# EAGLE schematic Arduino-M0-Mod1 (EAGLE 7.5.0)

## Sheet 1 of 2
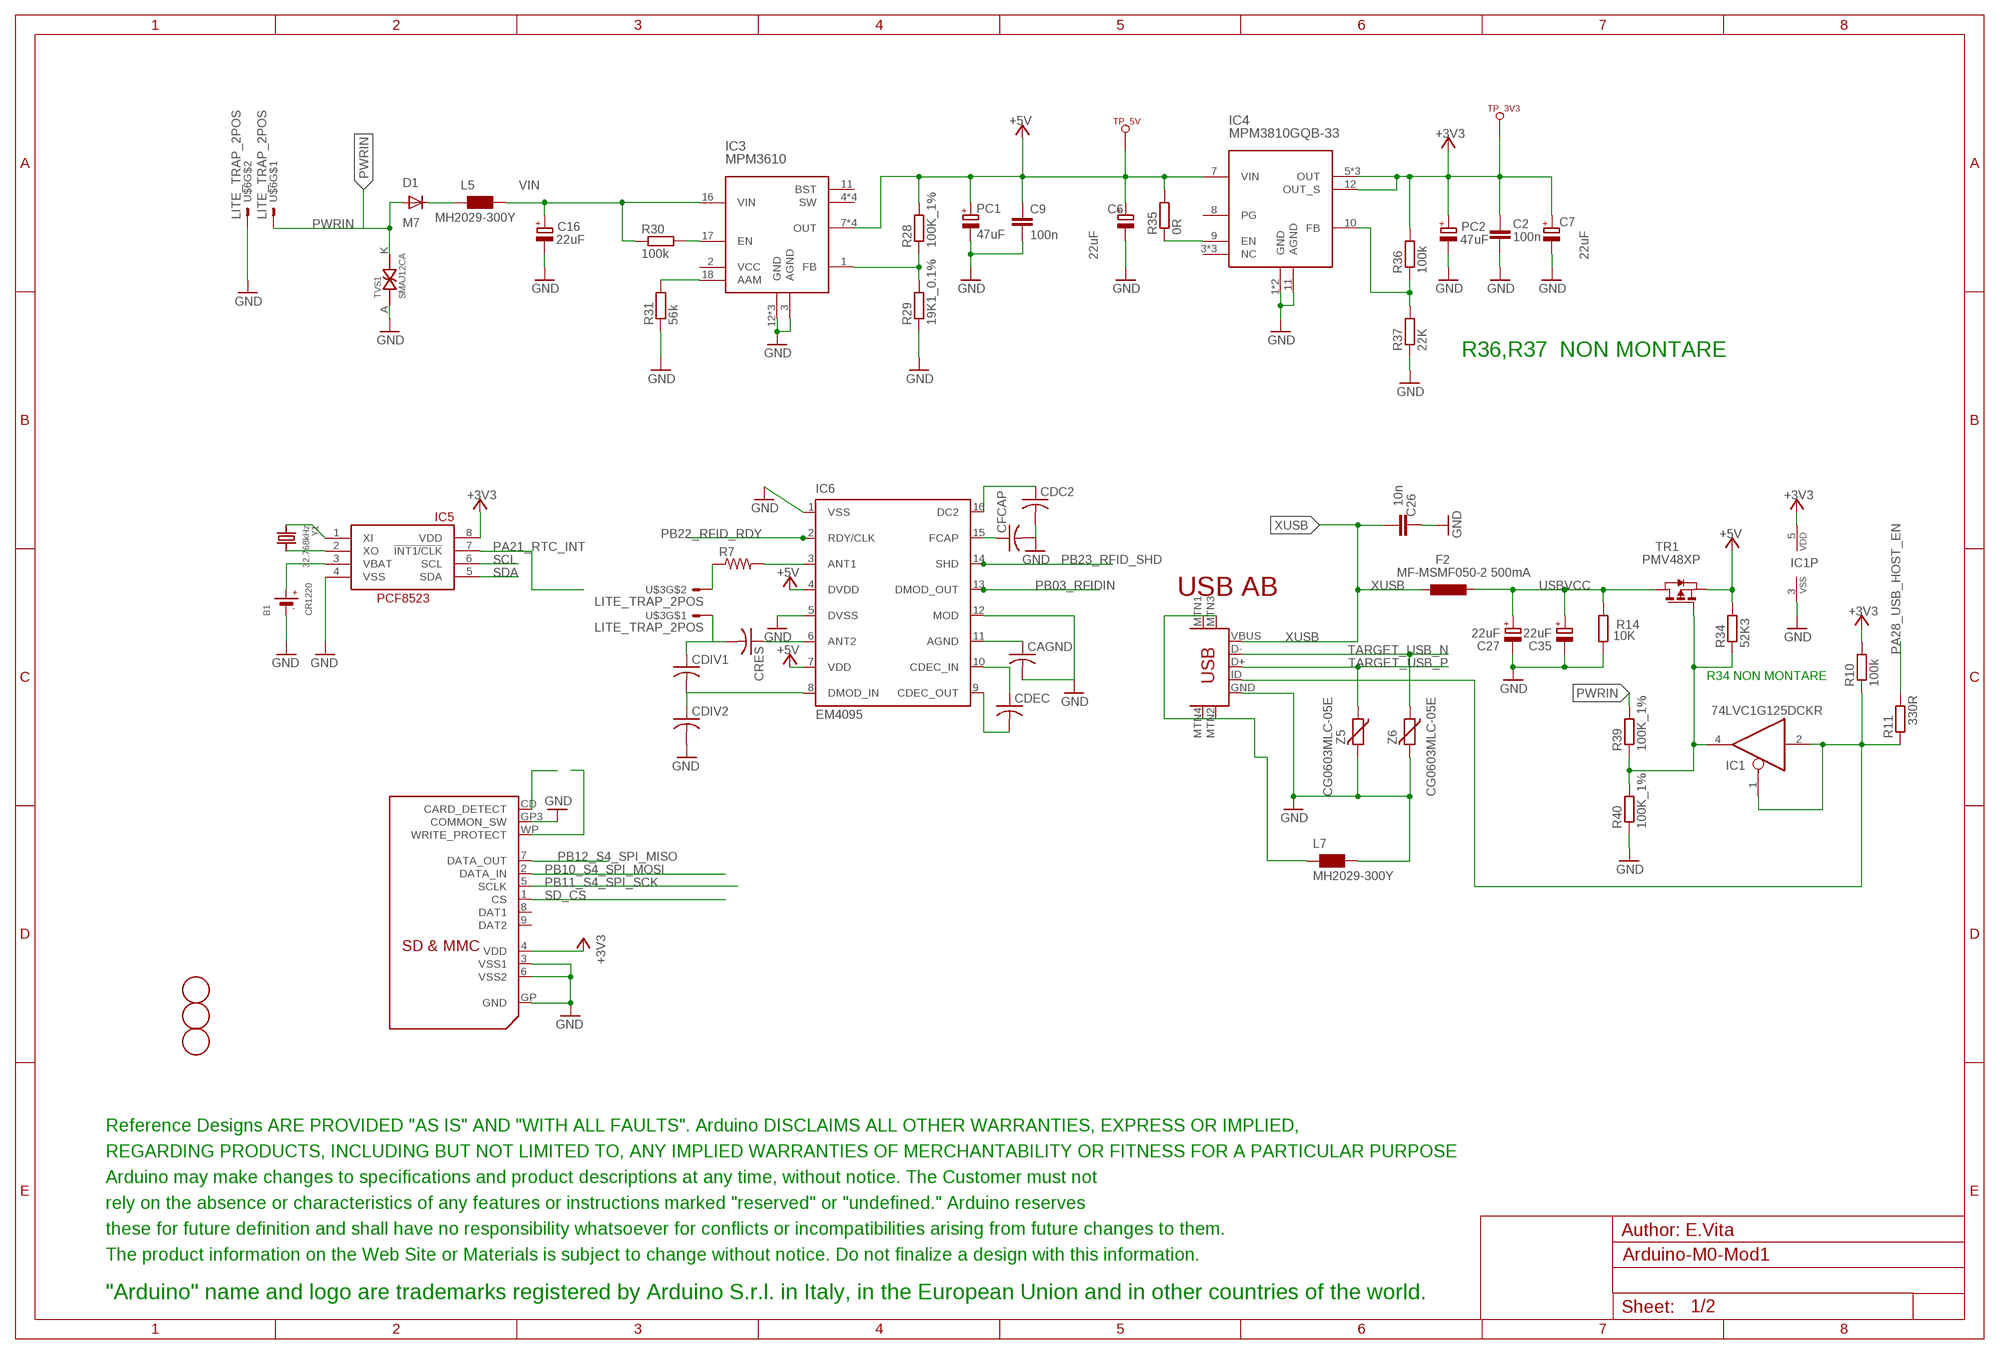
[diagram p0: schematic, sheet 1]

### Parts
B1  CR1220  BATTERYCR1220_SMT  [CR1220]
C2  100n  0015_100NF_0603  [C0603-ROUND]
C6  22uF  0167_  [SMC_B]
C7  22uF  0167_  [SMC_B]
C9  100n  0015_100NF_0603  [C0603-ROUND]
C16  22uF  0167_  [SMC_B]
C26  10n  0142_10NF_0603  [C0603-ROUND]
C27  22uF  0167_  [SMC_B]
C35  22uF  0167_  [SMC_B]
CAGND  C-USC1206K  [C1206K]
CDC2  C-USC1206K  [C1206K]
CDEC  C-USC1206K  [C1206K]
CDIV1  C-USC1206K  [C1206K]
CDIV2  C-USC1206K  [C1206K]
CFCAP  C-USC1206K  [C1206K]
CRES  C-USC1206K  [C1206K]
D1  M7  0020_M7  [SMB]
F2  MF-MSMF050-2 500mA  0002_MF-MSMF050-2  [L1812]
FD1  FIDUCIALMOUNT  [FIDUCIA-MOUNT]
FD2  FIDUCIALMOUNT  [FIDUCIA-MOUNT]
FD3  FIDUCIALMOUNT  [FIDUCIA-MOUNT]
IC1  74LVC1G125DCKR  0040_SN74LVC1G125DCKR  [SC70-5]
IC3  MPM3610  2093_MPM3610GQV-P  [QFN-20]
IC4  MPM3810GQB-33  2068_MPM3810GQB-33  [QFN-12]
IC5  RTC_PCF8523T  [SOIC8_150MIL]
IC6  EM4095  [SO16]
L5  MH2029-300Y  0001_BLM21PG300SN1D_/_MH2029-300Y  [0805]
L7  MH2029-300Y  0001_BLM21PG300SN1D_/_MH2029-300Y  [0805]
PC1  47uF  0113_47UF  [PANASONIC_D]
PC2  47uF  0113_47UF  [PANASONIC_D]
R7  R-US_R1206  [R1206]
R10  100k  0026_100K_0603  [R0603-ROUND]
R11  330R  0049_330R_0603  [R0603-ROUND]
R14  10K  0028_CR0603JW103L  [R0603-ROUND]
R28  100K_1%  2022_CR0603FW104L  [R0603-ROUND]
R29  19K1_0.1%  2339_  [R0603-ROUND]
R30  100k  0026_100K_0603  [R0603-ROUND]
R31  56k  0411_56K_0603  [R0603-ROUND]
R34  52K3  0180_52K3_0603  [R0603-ROUND]
R35  0R  0233_0R_0603  [R0603-ROUND]
R36  100k  0026_100K_0603  [R0603-ROUND]
R37  22K  0194_  [R0603-ROUND]
R39  100K_1%  2022_CR0603FW104L  [R0603-ROUND]
R40  100K_1%  2022_CR0603FW104L  [R0603-ROUND]
TP_3V3  TP_SP  [TP-SP]
TP_5V  TP_SP  [TP-SP]
TR1  PMV48XP  0297_PMV48XP  [SOT-23]
TVS1  SMAJ12CA  2194_SMAJ12CA  [SMA-TVS]
U$1  DISCLAIMER-SMALL  [DISCLAIMER]
U$3  LITE_TRAP_2POS  [LITE_TRAP_MINI]
U$4  SDMMC06132  [06132]
U$5  USB-MINIB-5PIN  [USB-MINIB]
U$6  LITE_TRAP_2POS  [LITE_TRAP_MINI]
Y1  32.768kHz  CRYSTAL8.0X3.8  [CRYSTAL_8X3.8]
Z5  CG0603MLC-05E  0010_BRNCG0603MLC-05E  [CT/CN0603]
Z6  CG0603MLC-05E  0010_BRNCG0603MLC-05E  [CT/CN0603]

### Nets
2GND [gnd]: L7.1 U$5.MTN1(MTN2) U$5.MTN2(MTN3) U$5.MTN3(MTN1) U$5.MTN4
+3V3: C2.2 C7.+ IC1.5(VDD) IC4.5(OUT) IC4.6(OUT) IC4.12(OUT_S) IC4.14(OUT) IC5.8(VDD) PC2.+ R10.2 R36.2 TP_3V3.X(TESTP) U$4.4(VDD) ; also sheet 2
+5V [usbvcc]: C6.+ C9.1 IC3.7(OUT) IC3.8(OUT) IC3.9(OUT) IC3.20(OUT) IC4.7(VIN) IC6.4(DVDD) IC6.7(VDD) PC1.+ R28.2 R34.2 R35.2 TP_5V.X(TESTP) TR1.2(S) ; also sheet 2
GND [gnd]: B1.- C2.1 C6.- C7.- C9.2 C16.- C26.2 C27.- C35.- CAGND.2 CDC2.2 CDIV2.2 CFCAP.2 IC1.3(VSS) IC3.3(AGND) IC3.12(GND) IC3.13(GND) IC3.14(GND) IC4.1(GND) IC4.2(GND) IC4.11(AGND) IC5.4(VSS) IC6.1(VSS) IC6.5(DVSS) IC6.12(MOD) L7.2 PC1.- PC2.- R14.1 R29.1 R31.1 R37.1 R40.1 TVS1.A(AK) U$4.3(VSS1) U$4.6(VSS2) U$4.GP3(COMMON_SW) U$4.GP(GND) U$5.GND U$6.P$3 U$6.P$4 Z5.2 Z6.2 ; also sheet 2
N$2: IC5.2(XO) Y1.P$4
N$3: IC5.1(XI) Y1.P$1
N$4: CFCAP.1 IC6.15(FCAP)
N$5: CAGND.1 IC6.11(AGND)
N$6: IC1.4(O) R34.1 R39.1 R40.2 TR1.3(G)
N$7: IC1.1(OE) IC1.2(I) R10.1 R11.1 U$5.ID
N$8: D1.C L5.1
N$9: IC4.9(EN) R35.1
N$11: IC4.10(FB) R36.1 R37.2
N$12: CRES.1 IC6.6(ANT2)
N$13: CDIV1.2 CDIV2.1 IC6.8(DMOD_IN)
N$14: R7.1 U$3.P$3 U$3.P$4
N$16: CDIV1.1 CRES.2 U$3.P$1 U$3.P$2
N$17: CDC2.1 IC6.16(DC2)
N$18: CDEC.2 IC6.9(CDEC_OUT)
N$19: CDEC.1 IC6.10(CDEC_IN)
N$20: IC6.3(ANT1) R7.2
N$26: IC3.1(FB) R28.1 R29.2
N$28: IC3.17(EN) R30.2
N$29: IC3.18(AAM) R31.2
PA21_RTC_INT: IC5.7(!INT1/CLK) ; also sheet 2
PA28_USB_HOST_EN: R11.2 ; also sheet 2
PB03_RFIDIN: IC6.13(DMOD_OUT) ; also sheet 2
PB10_S4_SPI_MOSI: U$4.2(DATA_IN) ; also sheet 2
PB11_S4_SPI_SCK: U$4.5(SCLK) ; also sheet 2
PB12_S4_SPI_MISO: U$4.7(DATA_OUT) ; also sheet 2
PB22_RFID_RDY: IC6.2(RDY/CLK) ; also sheet 2
PB23_RFID_SHD: IC6.14(SHD) ; also sheet 2
PWRIN [USB]: D1.A R39.2 TVS1.K(KA) U$6.P$1 U$6.P$2 ; also sheet 2
SCL: IC5.6(SCL)
SD_CD: U$4.CD(CARD_DETECT)
SD_CS: U$4.1(CS)
SD_WP: U$4.WP(WRITE_PROTECT)
SDA: IC5.5(SDA)
TARGET_USB_N [USBpair]: U$5.D- Z6.1 ; also sheet 2
TARGET_USB_P [USBpair]: U$5.D+ Z5.1 ; also sheet 2
USBVCC [usbvcc]: C27.+ C35.+ F2.1 R14.2 TR1.1(D)
VBAT1: B1.+$1(+) IC5.3(VBAT)
VIN [gnd]: C16.+ IC3.16(VIN) L5.2 R30.1
XUSB [usbvcc]: C26.1 F2.2 U$5.VBUS
Unconnected: IC3.2(VCC) IC3.4(SW) IC3.5(SW) IC3.6(SW) IC3.11(BST) IC3.19(SW) IC4.3(NC) IC4.4(NC) IC4.8(PG) IC4.13(NC) U$4.8(DAT1) U$4.9(DAT2)

### Notes on the sheet
- R36,R37  NON MONTARE
- USB AB
- R34 NON MONTARE
- Author: E.Vita

## Sheet 2 of 2
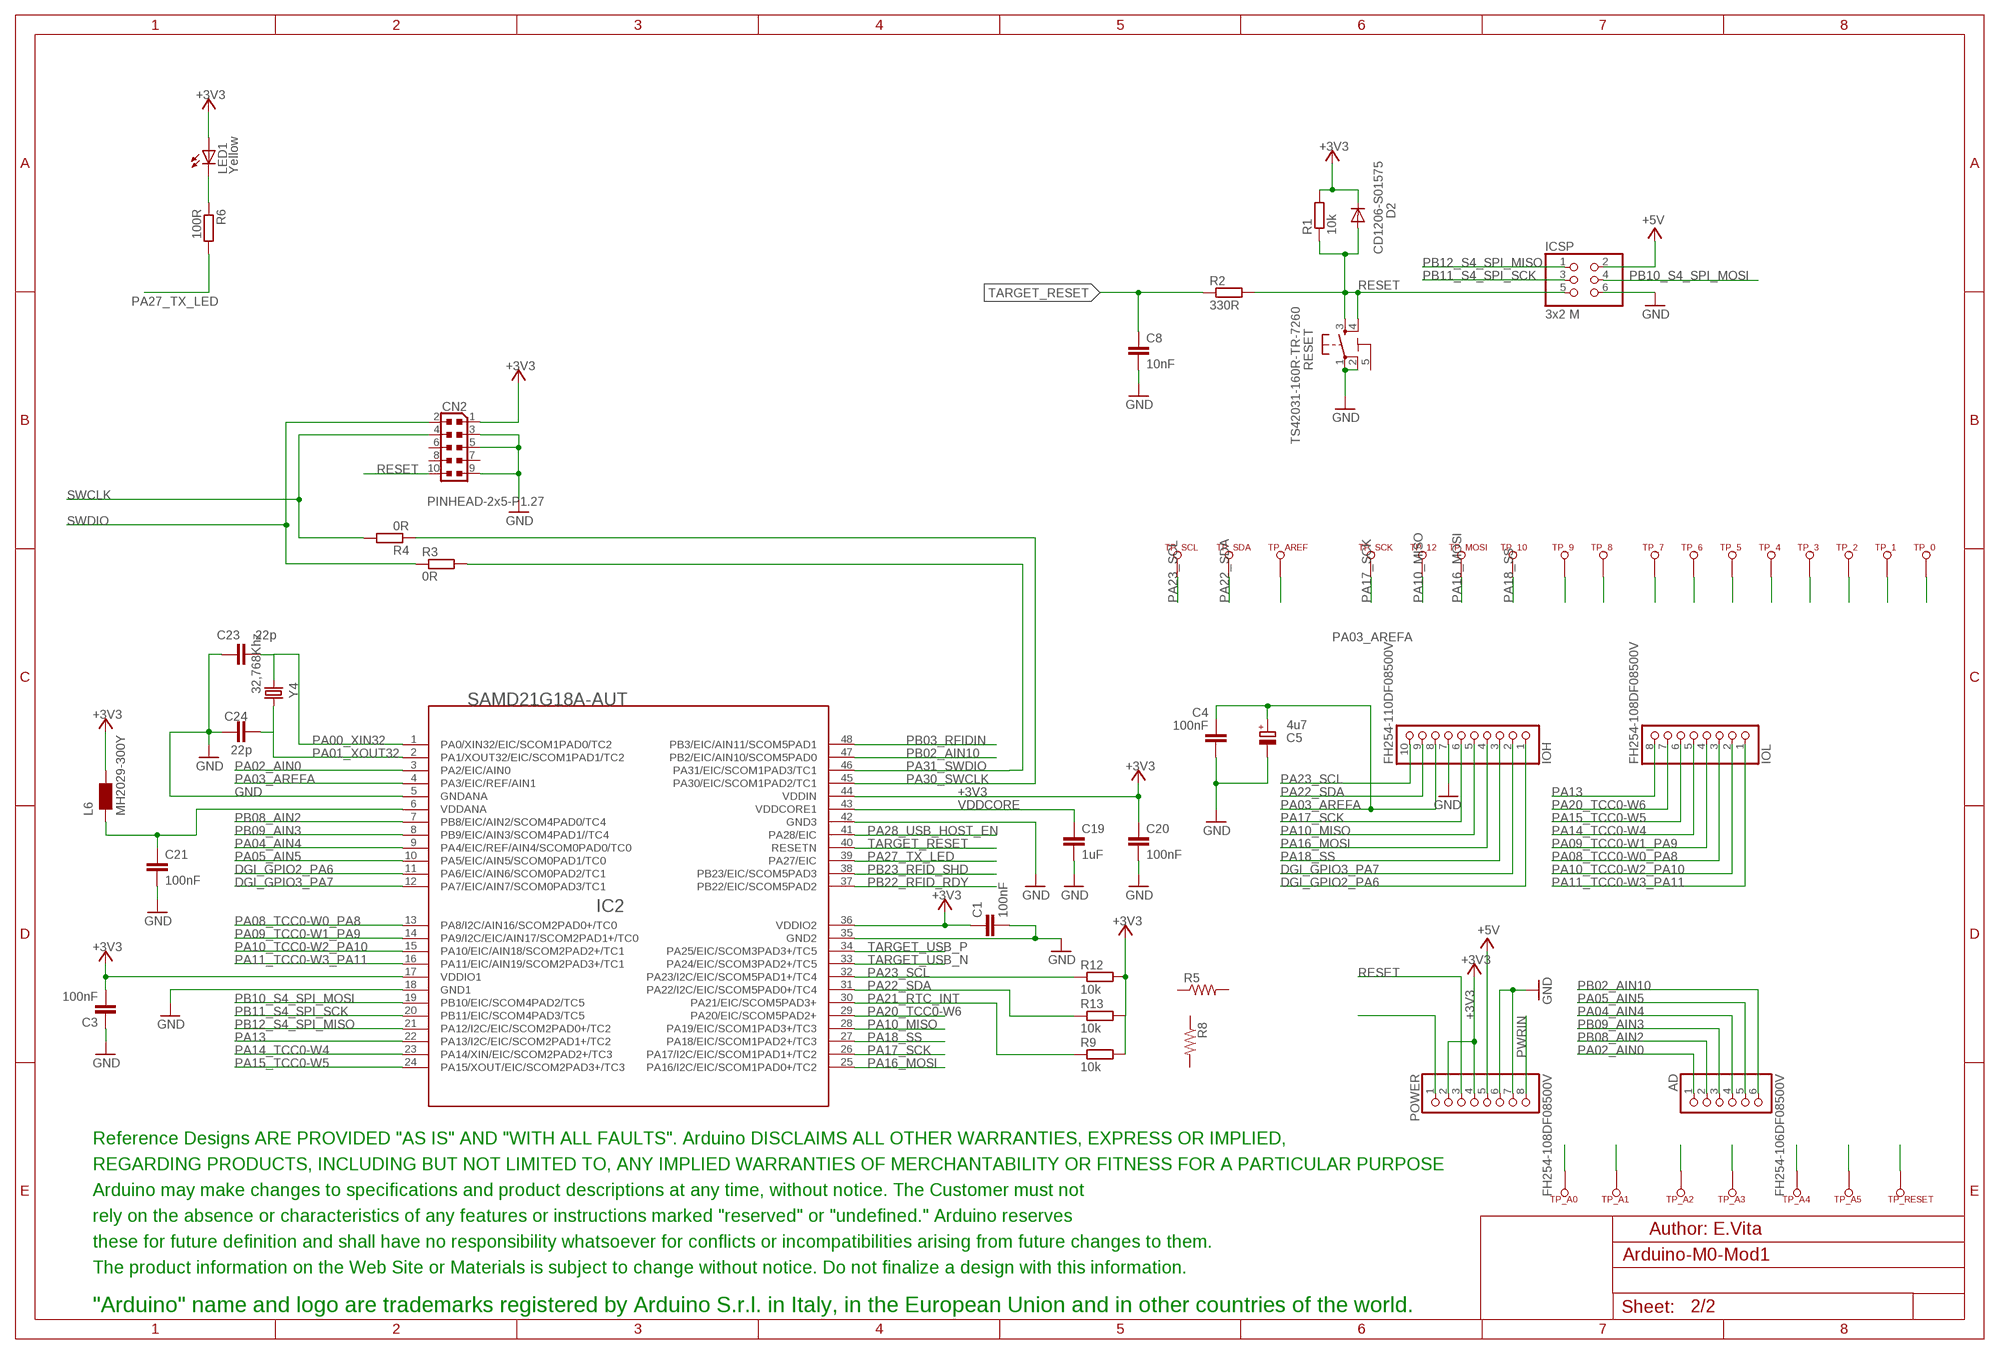
[diagram p1: schematic, sheet 2]

### Parts
AD  FH254-106DF08500V  1682_20TW-535_STD  [1X06]
C1  100nF  0015_100NF_0603  [C0603-ROUND]
C3  100nF  0015_100NF_0603  [C0603-ROUND]
C4  100nF  0015_100NF_0603  [C0603-ROUND]
C5  4u7  0474_TAJA475M016RNJ  [SMC_A]
C8  10nF  0142_10NF_0603  [C0603-ROUND]
C19  1uF  0006_1UF_0603/GRM188R61E105KA12D  [C0603-ROUND]
C20  100nF  0015_100NF_0603  [C0603-ROUND]
C21  100nF  0015_100NF_0603  [C0603-ROUND]
C23  22p  0014_22PF_0603  [C0603-ROUND]
C24  22p  0014_22PF_0603  [C0603-ROUND]
CN2  PINHEAD-2x5-P1.27  0171_PH127-205DF055G00AROUND-PADS  [PINHEAD_2X05_127]
D2  CD1206-S01575  0012_CD1206-S01575  [MINIMELF]
IC2  SAMD21G18A-AUT  1792_SAMD21G18A-AUT  [TQFP48-7X7]
ICSP  3x2 M  0114_PH254-203DF118A00V  [2X03]
IOH  FH254-110DF08500V  1684_20TW-537  [1X10]
IOL  FH254-108DF08500V  1683_20TW-536  [1X08]
L6  MH2029-300Y  0001_BLM21PG300SN1D_/_MH2029-300Y  [0805]
LED1  Yellow  0044_KPT-2012YC  [CHIPLED_0805]
POWER  FH254-108DF08500V  1683_20TW-536  [1X08]
R1  10k  0028_CR0603JW103L  [R0603-ROUND]
R2  330R  0049_330R_0603  [R0603-ROUND]
R3  0R  0233_0R_0603  [R0603-ROUND]
R4  0R  0233_0R_0603  [R0603-ROUND]
R5  R-US_R1206  [R1206]
R6  100R  0233_0R_0603  [R0603-ROUND]
R8  R-US_R1206  [R1206]
R9  10k  0028_CR0603JW103L  [R0603-ROUND]
R12  10k  0028_CR0603JW103L  [R0603-ROUND]
R13  10k  0028_CR0603JW103L  [R0603-ROUND]
RESET  TS42031-160R-TR-7260  0946_TS42031-160W-TR-7260  [TS42]
TP_0  TP_SP  [TP-SP]
TP_1  TP_SP  [TP-SP]
TP_2  TP_SP  [TP-SP]
TP_3  TP_SP  [TP-SP]
TP_4  TP_SP  [TP-SP]
TP_5  TP_SP  [TP-SP]
TP_6  TP_SP  [TP-SP]
TP_7  TP_SP  [TP-SP]
TP_8  TP_SP  [TP-SP]
TP_9  TP_SP  [TP-SP]
TP_10  TP_SP  [TP-SP]
TP_12  TP_SP  [TP-SP]
TP_A0  TP_SP  [TP-SP]
TP_A1  TP_SP  [TP-SP]
TP_A2  TP_SP  [TP-SP]
TP_A3  TP_SP  [TP-SP]
TP_A4  TP_SP  [TP-SP]
TP_A5  TP_SP  [TP-SP]
TP_AREF  TP_SP  [TP-SP]
TP_MOSI  TP_SP  [TP-SP]
TP_RESET  TP_SP  [TP-SP]
TP_SCK  TP_SP  [TP-SP]
TP_SCL  TP_SP  [TP-SP]
TP_SDA  TP_SP  [TP-SP]
U$2  DISCLAIMER-SMALL  [DISCLAIMER]
Y4  32,768Khz  0213_ABS07-32.768KHZ-T  [RESONATOR_EPSON_FC_145]

### Nets
+3V3: C1.1 C3.2 C20.1 CN2.1 D2.C IC2.17(VDDIO1) IC2.36(VDDIO2) IC2.44(VDDIN) L6.2 LED1.A POWER.2 POWER.4 R1.2 R9.2 R12.2 R13.2 ; also sheet 1
+5V [usbvcc]: ICSP.2 POWER.5 ; also sheet 1
DGI_GPIO1: TP_7.X(TESTP)
DGI_GPIO2_PA6: IC2.11(PA6/EIC/AIN6/SCOM0PAD2/TC1) IOH.1 TP_8.X(TESTP)
DGI_GPIO3_PA7: IC2.12(PA7/EIC/AIN7/SCOM0PAD3/TC1) IOH.2 TP_9.X(TESTP)
GND [gnd]: C1.2 C3.1 C4.2 C5.- C8.2 C19.2 C20.2 C21.2 C23.1 C24.1 CN2.3 CN2.5 CN2.9 IC2.5(GNDANA) IC2.18(GND1) IC2.35(GND2) IC2.42(GND3) ICSP.6 IOH.7 POWER.6 POWER.7 RESET.1 RESET.2 ; also sheet 1
N$1: LED1.C R6.1
N$10: C21.1 IC2.6(VDDANA) L6.1
N$56: POWER.1
PA00_XIN32: C23.2 IC2.1(PA0/XIN32/EIC/SCOM1PAD0/TC2) Y4.P$1
PA01_XOUT32: C24.2 IC2.2(PA1/XOUT32/EIC/SCOM1PAD1/TC2) Y4.P$2
PA02_AIN0: AD.1 IC2.3(PA2/EIC/AIN0) TP_A0.X(TESTP)
PA03_AREFA: C4.1 C5.+ IC2.4(PA3/EIC/REF/AIN1) IOH.8 TP_AREF.X(TESTP)
PA04_AIN4: AD.4 IC2.9(PA4/EIC/REF/AIN4/SCOM0PAD0/TC0) TP_A3.X(TESTP)
PA05_AIN5: AD.5 IC2.10(PA5/EIC/AIN5/SCOM0PAD1/TC0) TP_A4.X(TESTP)
PA08_TCC0-W0_PA8: IC2.13(PA8/I2C/AIN16/SCOM2PAD0+/TC0) IOL.3 TP_2.X(TESTP)
PA09_TCC0-W1_PA9: IC2.14(PA9/I2C/EIC/AIN17/SCOM2PAD1+/TC0) IOL.4 TP_3.X(TESTP)
PA10_MISO: IC2.28(PA19/EIC/SCOM1PAD3+/TC3) IOH.5 TP_12.X(TESTP)
PA10_TCC0-W2_PA10: IC2.15(PA10/EIC/AIN18/SCOM2PAD2+/TC1) IOL.2 TP_1.X(TESTP)
PA11_TCC0-W3_PA11: IC2.16(PA11/EIC/AIN19/SCOM2PAD3+/TC1) IOL.1 TP_0.X(TESTP)
PA13: IC2.22(PA13/I2C/EIC/SCOM2PAD1+/TC2) IOL.8
PA14_TCC0-W4: IC2.23(PA14/XIN/EIC/SCOM2PAD2+/TC3) IOL.5 TP_4.X(TESTP)
PA15_TCC0-W5: IC2.24(PA15/XOUT/EIC/SCOM2PAD3+/TC3) IOL.6 TP_5.X(TESTP)
PA16_MOSI: IC2.25(PA16/I2C/EIC/SCOM1PAD0+/TC2) IOH.4 TP_MOSI.X(TESTP)
PA17_SCK: IC2.26(PA17/I2C/EIC/SCOM1PAD1+/TC2) IOH.6 TP_SCK.X(TESTP)
PA18_SS: IC2.27(PA18/EIC/SCOM1PAD2+/TC3) IOH.3 TP_10.X(TESTP)
PA20_TCC0-W6: IC2.29(PA20/EIC/SCOM5PAD2+) IOL.7 TP_6.X(TESTP)
PA21_RTC_INT: IC2.30(PA21/EIC/SCOM5PAD3+) R9.1 ; also sheet 1
PA22_SDA: IC2.31(PA22/I2C/EIC/SCOM5PAD0+/TC4) IOH.9 R13.1 TP_SDA.X(TESTP)
PA23_SCL: IC2.32(PA23/I2C/EIC/SCOM5PAD1+/TC4) IOH.10 R12.1 TP_SCL.X(TESTP)
PA27_TX_LED: IC2.39(PA27/EIC) R6.2
PA28_USB_HOST_EN: IC2.41(PA28/EIC) ; also sheet 1
PA30_SWCLK: IC2.45(PA30/EIC/SCOM1PAD2/TC1) R4.1
PA31_SWDIO: IC2.46(PA31/EIC/SCOM1PAD3/TC1) R3.2
PB02_AIN10: AD.6 IC2.47(PB2/EIC/AIN10/SCOM5PAD0) TP_A5.X(TESTP)
PB03_RFIDIN: IC2.48(PB3/EIC/AIN11/SCOM5PAD1) ; also sheet 1
PB08_AIN2: AD.2 IC2.7(PB8/EIC/AIN2/SCOM4PAD0/TC4) TP_A1.X(TESTP)
PB09_AIN3: AD.3 IC2.8(PB9/EIC/AIN3/SCOM4PAD1//TC4) TP_A2.X(TESTP)
PB10_S4_SPI_MOSI: IC2.19(PB10/EIC/SCOM4PAD2/TC5) ICSP.4 ; also sheet 1
PB11_S4_SPI_SCK: IC2.20(PB11/EIC/SCOM4PAD3/TC5) ICSP.3 ; also sheet 1
PB12_S4_SPI_MISO: IC2.21(PA12/I2C/EIC/SCOM2PAD0+/TC2) ICSP.1 ; also sheet 1
PB22_RFID_RDY: IC2.37(PB22/EIC/SCOM5PAD2) ; also sheet 1
PB23_RFID_SHD: IC2.38(PB23/EIC/SCOM5PAD3) ; also sheet 1
PWRIN [USB]: POWER.8 ; also sheet 1
RESET: CN2.10 D2.A ICSP.5 POWER.3 R1.1 R2.2 RESET.3 RESET.4 TP_RESET.X(TESTP)
SWCLK: CN2.4 R4.2
SWDIO: CN2.2 R3.1
TARGET_RESET: C8.1 IC2.40(RESETN) R2.1
TARGET_USB_N [USBpair]: IC2.33(PA24/EIC/SCOM3PAD2+/TC5) ; also sheet 1
TARGET_USB_P [USBpair]: IC2.34(PA25/EIC/SCOM3PAD3+/TC5) ; also sheet 1
VDDCORE: C19.1 IC2.43(VDDCORE1)
Unconnected: CN2.6 CN2.7 CN2.8 R5.1 R5.2 R8.1 R8.2

### Notes on the sheet
- Author: E.Vita

## Power pins joined to a net without a drawn wire
5-GND: RESET.5(5-GND)

## Library data of the parts
AD = Connettori:1682_20TW-535: Female Gray Connector strip for Arduino 3V3 bases - 6x1 F V h 8,5 p2,54; MONTHLY_USAGE: 86722.85; PART_NUMBER: 20TW-535; PRICE: _0.03; SUPPLIER: CBC_elettronica__s.r.l.; TYPE: Connettori
B1 = microbuilder:BATTERY: CR1220 SMT - Digikey: 3001K-ND CD2032 BAT-HLD-001 - Digikey: BAT-HLD-001-ND
C1 C3 C4 C20 C21 = Condensatori:0015_100NF_0603: 100nF 0603 50V; CASE: 0603; MONTHLY_USAGE: _____; PART_NUMBER: cl10b104kbnc; PRICE: _____; SUPPLIER: _____; TYPE: Condensatori
C2 C9 = Condensatori:0015_100NF_0603: 100nF 0603 50V; CASE: 0603; MONTHLY_USAGE: _____; PART_NUMBER: cl10b104kbnc; PRICE: _____; SUPPLIER: _____; TYPE: Condensatori; VALUE: 100nF
C5 = Condensatori:0474_TAJA475M016RNJ: 4u7 tantalio Case A - testa gialla -Tantalio; CASE: CaseA_(1206); MONTHLY_USAGE: _____; PART_NUMBER: TAJA475M016RNJ; PRICE: _____; SUPPLIER: _____; TYPE: Condensatori
C6 C7 C16 C27 C35 = Condensatori:0167_: 22uF 25V; MONTHLY_USAGE: _____; PRICE: _____; SUPPLIER: _____; TYPE: Condensatori
C8 = Condensatori:0142_10NF_0603: 10nF 0603; CASE: 0603; MONTHLY_USAGE: _____; PART_NUMBER: 10nF_0603; PRICE: _____; SUPPLIER: _____; TYPE: Condensatori
C19 = Condensatori:0006_1UF_0603/GRM188R61E105KA12D: 1uF 0603; CASE: 0603; MONTHLY_USAGE: _____; PART_NUMBER: 1uF_0603/GRM188R61E105KA12D; PRICE: _____; SUPPLIER: _____; TYPE: Condensatori
C23 C24 = Condensatori:0014_22PF_0603: 22pF 0603; CASE: 0603; MONTHLY_USAGE: _____; PART_NUMBER: 22pF_0603; PRICE: _____; SUPPLIER: _____; TYPE: Condensatori
C26 = Condensatori:0142_10NF_0603: 10nF 0603; CASE: 0603; MONTHLY_USAGE: _____; PART_NUMBER: 10nF_0603; PRICE: _____; SUPPLIER: _____; TYPE: Condensatori; VALUE: 10nF
CAGND CDC2 CDEC CDIV1 CDIV2 CFCAP CRES = rcl:C-US: CAPACITOR, American symbol
CN2 = Connettori:0171_PH127-205DF055G00A: 2x5 PASSO 1,27
D1 = Diodi:0020_M7: 1.0A 40V SURFACE MOUNT GLASS PASSIVATED RECTIFIER M7; CASE: SMA; MONTHLY_USAGE: _____; PART_NUMBER: M7; PRICE: _____; SUPPLIER: _____; TYPE: Diodi
D2 = Diodi:0012_CD1206-S01575: small-signal high-speed Switching Diodes CD1206; CASE: 1206; MONTHLY_USAGE: _____; PART_NUMBER: CD1206-S01575; PRICE: _____; SUPPLIER: _____; TYPE: Diodi
F2 = Protezione:0002_MF-MSMF050-2: 500 mA Multifuse � Polyfuse; MONTHLY_USAGE: _____; PART_NUMBER: MF-MSMF050-2; PRICE: _____; SUPPLIER: _____; TYPE: Protezione
FD1-FD3 = SmartPrj:FIDUCIALMOUNT
IC1 = IntegratedCircuits:0040_SN74LVC1G125DCKR: Single bus buffer with 3-state output; CASE: SC70; MONTHLY_USAGE: _____; PART_NUMBER: SN74LVC1G125DCKR; PRICE: _____; SUPPLIER: _____; TYPE: Circuito_Integrato
IC2 = IntegratedCircuits:1792_SAMD21G18A-AUT: Atmel D21 32bit ARM Cortex-M0 microcontroller - 48 PIN TQFP 256KB flash memory + 32KB SRAM
IC3 = IntegratedCircuits:2093_MPM3610GQV-P: MPM3610 Step Down Regulator; CASE: QFN-20; PART_NUMBER: MPM3610GQV-P; TYPE: Circuito_Integrato
IC4 = IntegratedCircuits:2068_MPM3810GQB-33: MPM3810 6V Input, 1.2A Module Synchronous Step-Down Converter with Integrated Inductor; PART_NUMBER: MPM3810GQB-33
IC5 = microbuilder:RTC_PCF8523
IC6 = em-microelectronic:EM4095: Read/Write analog front end for 125kHz RFID Basestation Source: http://www.emmicroelectronic.com/webfiles/Product/RFID/DS/EM4095_DS.pdf
ICSP = Connettori:0114_PH254-203DF118A00V: 3x2 M V h 8,5 mm p2,54; MONTHLY_USAGE: _____; PART_NUMBER: PH254-203DF118A00V; PRICE: _____; SUPPLIER: _____; TYPE: Connettori; VALUE: ICSP
IOH = Connettori:1684_20TW-537: Female Gray Connector strip for Arduino 3V3 bases - 10x1 F V h 8,5 p2,54mm; MONTHLY_USAGE: _____; PART_NUMBER: 20TW-537; PRICE: _____; SUPPLIER: _____; TYPE: Connettori
IOL POWER = Connettori:1683_20TW-536: Female Gray Connector strip for Arduino 3V3 bases - 8x1 F V h 8,5 p2,54mm; MONTHLY_USAGE: _____; PART_NUMBER: 20TW-536; PRICE: _____; SUPPLIER: _____; TYPE: Connettori
L5-L7 = Protezione:0001_BLM21PG300SN1D_/_MH2029-300Y: BLM21; MONTHLY_USAGE: _____; PART_NUMBER: BLM21PG300SN1D_/_MH2029-300Y; PRICE: _____; SUPPLIER: _____; TYPE: Protezione
LED1 = Opto:0044_KPT-2012YC: LED YELLOW - SMD - 0805; MONTHLY_USAGE: _____; PART_NUMBER: KPT-2012YC; PRICE: _____; SUPPLIER: _____; TYPE: Opto
PC1 PC2 = Condensatori:0113_47UF: 47uF; MONTHLY_USAGE: _____; PART_NUMBER: 47uF; PRICE: _____; SUPPLIER: _____; TYPE: Condensatori
R1 R9 R12 R13 = Resistenze:0028_CR0603JW103L: 10K 0603; CASE: 0603; MONTHLY_USAGE: _____; PART_NUMBER: CR0603JW103L; PRICE: _____; SUPPLIER: _____; TYPE: Resistenze
R2 R11 = Resistenze:0049_330R_0603: 330R 0603; CASE: 0603; MONTHLY_USAGE: _____; PART_NUMBER: 330R_0603; PRICE: _____; SUPPLIER: _____; TYPE: Resistenze
R3 R4 R35 = Resistenze:0233_0R_0603: 0R 0603; CASE: 0603; MONTHLY_USAGE: _____; PART_NUMBER: 0R_0603; PRICE: _____; SUPPLIER: _____; TYPE: Resistenze
R5 R7 R8 = rcl:R-US_: RESISTOR, American symbol
R6 = Resistenze:0233_0R_0603: 0R 0603; CASE: 0603; MONTHLY_USAGE: _____; PART_NUMBER: 0R_0603; PRICE: _____; SUPPLIER: _____; TYPE: Resistenze; VALUE: 0R
R10 R30 R36 = Resistenze:0026_100K_0603: 100K 0603; CASE: 0603; MONTHLY_USAGE: _____; PART_NUMBER: 100K_0603; PRICE: _____; SUPPLIER: _____; TYPE: Resistenze
R14 = Resistenze:0028_CR0603JW103L: 10K 0603; CASE: 0603; MONTHLY_USAGE: _____; PART_NUMBER: CR0603JW103L; PRICE: _____; SUPPLIER: _____; TYPE: Resistenze; VALUE: 10k
R28 R39 R40 = Resistenze:2022_CR0603FW104L: 0603 Resistor 100K 1%; PART_NUMBER: CR0603FW104L
R29 = Resistenze:2339_: 19K1 0,1% 0603; CASE: 0603; MONTHLY_USAGE: _____; PRICE: _____; SUPPLIER: _____; TYPE: Resistenze; VALUE: 19K1_0,1%
R31 = Resistenze:0411_56K_0603: 56K 0603; CASE: 0603; MONTHLY_USAGE: _____; PART_NUMBER: 56K_0603; PRICE: _____; SUPPLIER: _____; TYPE: Resistenze
R34 = Resistenze:0180_52K3_0603: 52k3 0603; CASE: 0603; MONTHLY_USAGE: _____; PART_NUMBER: 52k3_0603; PRICE: _____; SUPPLIER: _____; TYPE: Resistenze; VALUE: 52k3
R37 = Resistenze:0194_: 22K 0603; CASE: 0603; MONTHLY_USAGE: _____; PRICE: _____; SUPPLIER: _____; TYPE: Resistenze; VALUE: 22K_1%
RESET = Switches:0946_TS42031-160W-TR-7260: Pushbutton 6x6 Smd - White; MONTHLY_USAGE: _____; PART_NUMBER: IT-1157AHNP-160G-G_GTR; PRICE: _____; SUPPLIER: _____; TYPE: Switches; VALUE: TS42
TP_0 TP_1-TP_3 TP_3V3 TP_4 TP_5 TP_5V TP_6-TP_10 TP_12 TP_A0 TP_A1-TP_A5 TP_AREF TP_MOSI TP_RESET TP_SCK TP_SCL TP_SDA = SmartPrj:TP_SP
TR1 = Transistors:0297_PMV48XP: 20 V, 3.5 A P-channel Trench MOSFET - PMV48XP; CASE: SOT23; MONTHLY_USAGE: _____; PART_NUMBER: PMV48XP; PRICE: _____; SUPPLIER: _____; TYPE: Transistor
TVS1 = Protezione:2194_SMAJ12CA: TVS Bidirectional 400W 12V, case DO-214AC (SMA); CASE: SMA-TVS; PART_NUMBER: SMAJ12CA; TYPE: Protezione
U$1 U$2 = Misc:DISCLAIMER-SMALL: DISCLAIMER
U$3 U$6 = con-molex:LITE_TRAP_2POS
U$4 = microbuilder:SDMMC: SD MMC Card holder 4UCON part #06132 - easy to solder
U$5 = USB_miniB:USB-MINIB
Y1 = microbuilder:CRYSTAL: Crystals HC49UP - Surface Mount Crystal 4.0MHz 18pF +/-30ppm Surface Mount Crystal [Digikey: 535-9857-1-ND] 12.0 MHz Surface Mount Crystal [Digikey: 535-9869-6-ND] 25.0 MHz Surface Mount Crystal [Digikey: 535-9078-1-ND] 2.5 x 2.0mm - MEMs SMT Crystal 16.0 MHz 10pF 20ppm 2.5 x 2.0mm Crystal [Digikey -40-85°C: 535-10923-1-ND] 3.2 x 2.5mm - MEMs SMT Crystal 12.0 MHz 8pF 15ppm 3.2 x 2.5mm Crystal [Digikey: -10-70°C: 644-1047-1-ND -40-125°C: 644-1128-1-ND] 40~85°C cheaper: 644-1173-6-ND 16.0 MHz 8pF 15ppm 3.2 x 2.5mm Crystal [Digikey: -10-70°C: 644-1049-1-ND -40-125°C: 644-1129-2-ND]-40~85°C cheaper: 644-1175-6-ND 16.0 MHz 10pF 10ppm 3.2 x 2.5mm Crystal [Digikey: 644-1100-1-ND] 27.12 MHz 18pF 30ppm 3.2 x 2.5mm Crystal [Digikey: 887-1424-1-ND] 27.12MHz 10pF 10ppm 3.2 x 2.5mm Crystal [Digikey: 887-1329-1-ND] 4.9 x 1.8mm - MEMs SMT Crystal 32.768 KHz 12.5pF 20ppm 4.9 x 1.8mm Crystal [Digikey: SE2415CT-ND] 8.0 x 3.8mm - Surface Mount Crystal 32.768kHz 12.5pF 20ppm -40°C-85°C [Digikey: 535-9166-2-ND] Cylinder 32.768KHz Cylinder Crystal (2x6mm body) [Ex. Digikey: 300-8341-2-ND]
Y4 = Cristalli:0213_ABS07-32.768KHZ-T: 32,768KHz - SMD; MONTHLY_USAGE: _____; PART_NUMBER: ABS07-32.768KHZ-T; PRICE: _____; SUPPLIER: _____; TYPE: Cristalli; VALUE: 32,768Khz_SMD
Z5 Z6 = Protezione:0010_BRNCG0603MLC-05E: CG0603MLC-05E; MONTHLY_USAGE: _____; PART_NUMBER: BRNCG0603MLC-05E; PRICE: _____; SUPPLIER: _____; TYPE: Protezione; VALUE: BRNCG0603MLC-05E

## Net classes
1 USB: width 0.203 mm, drill 0.305 mm, clearance 0.178 mm
2 gnd: width 0.254 mm, drill 0.254 mm, clearance 0.178 mm
3 usbvcc: width 0.203 mm, drill 0.406 mm, clearance 0.178 mm
4 USBpair: width 0.254 mm, drill 0.406 mm, clearance 0.406 mm